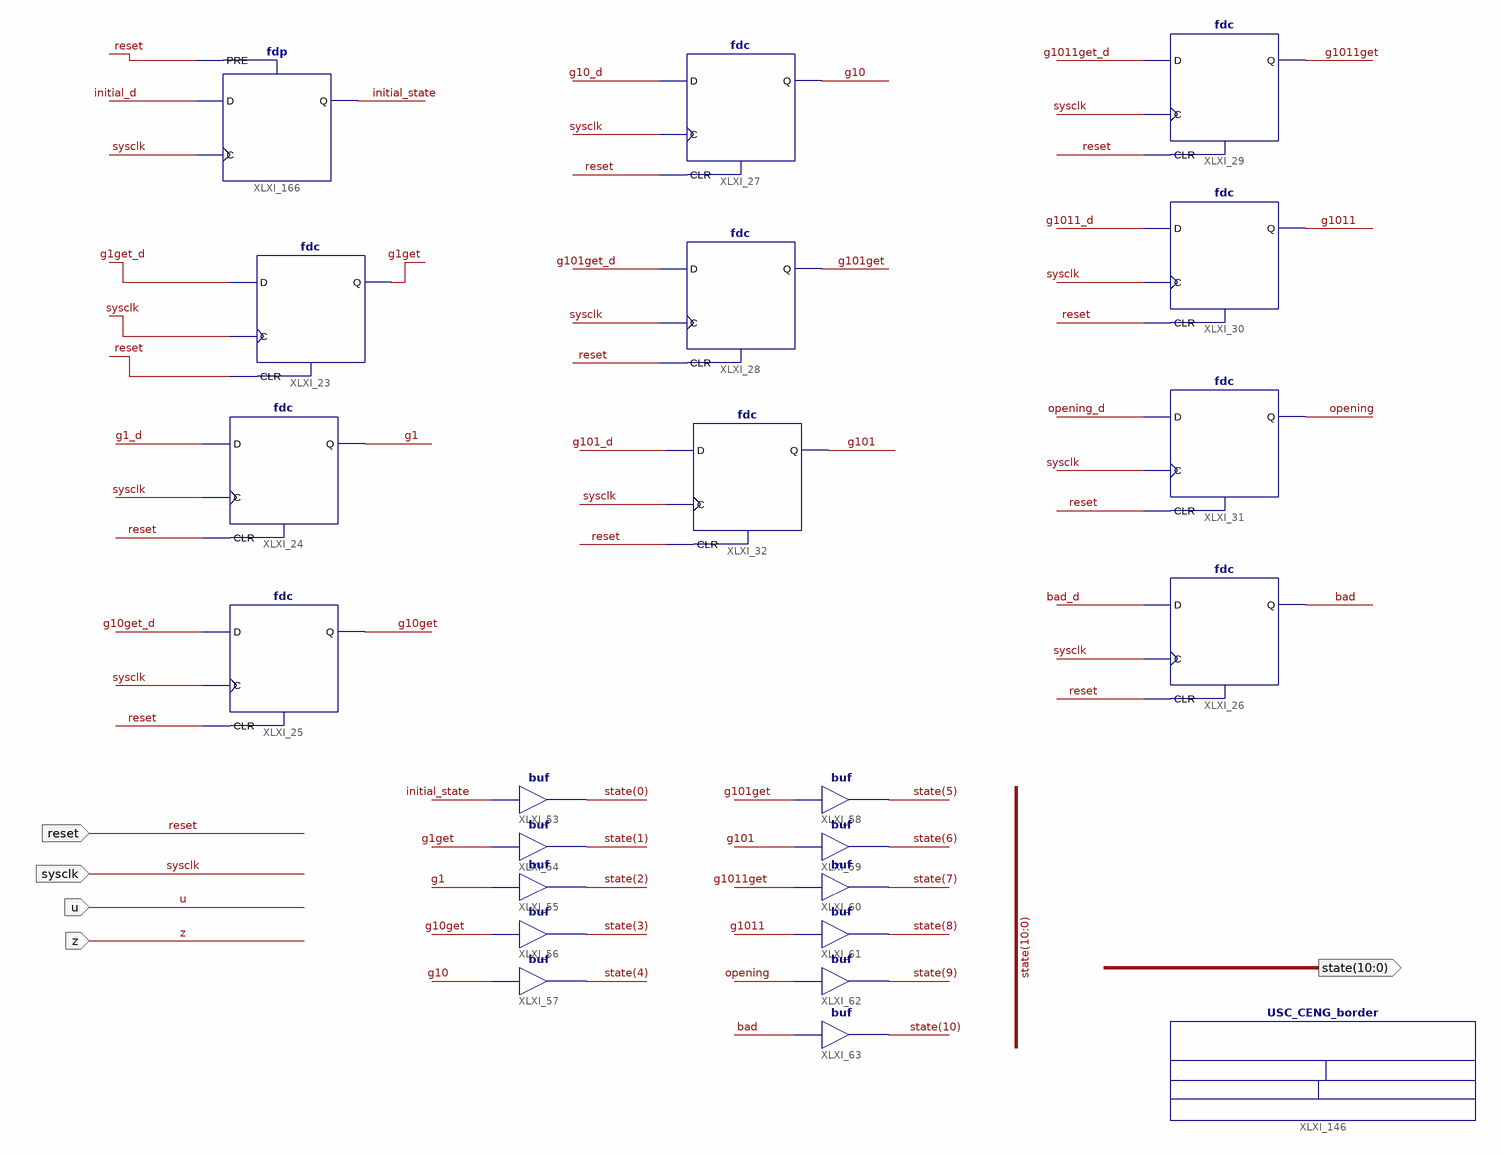
[diagram p0: schematic sheet 1]
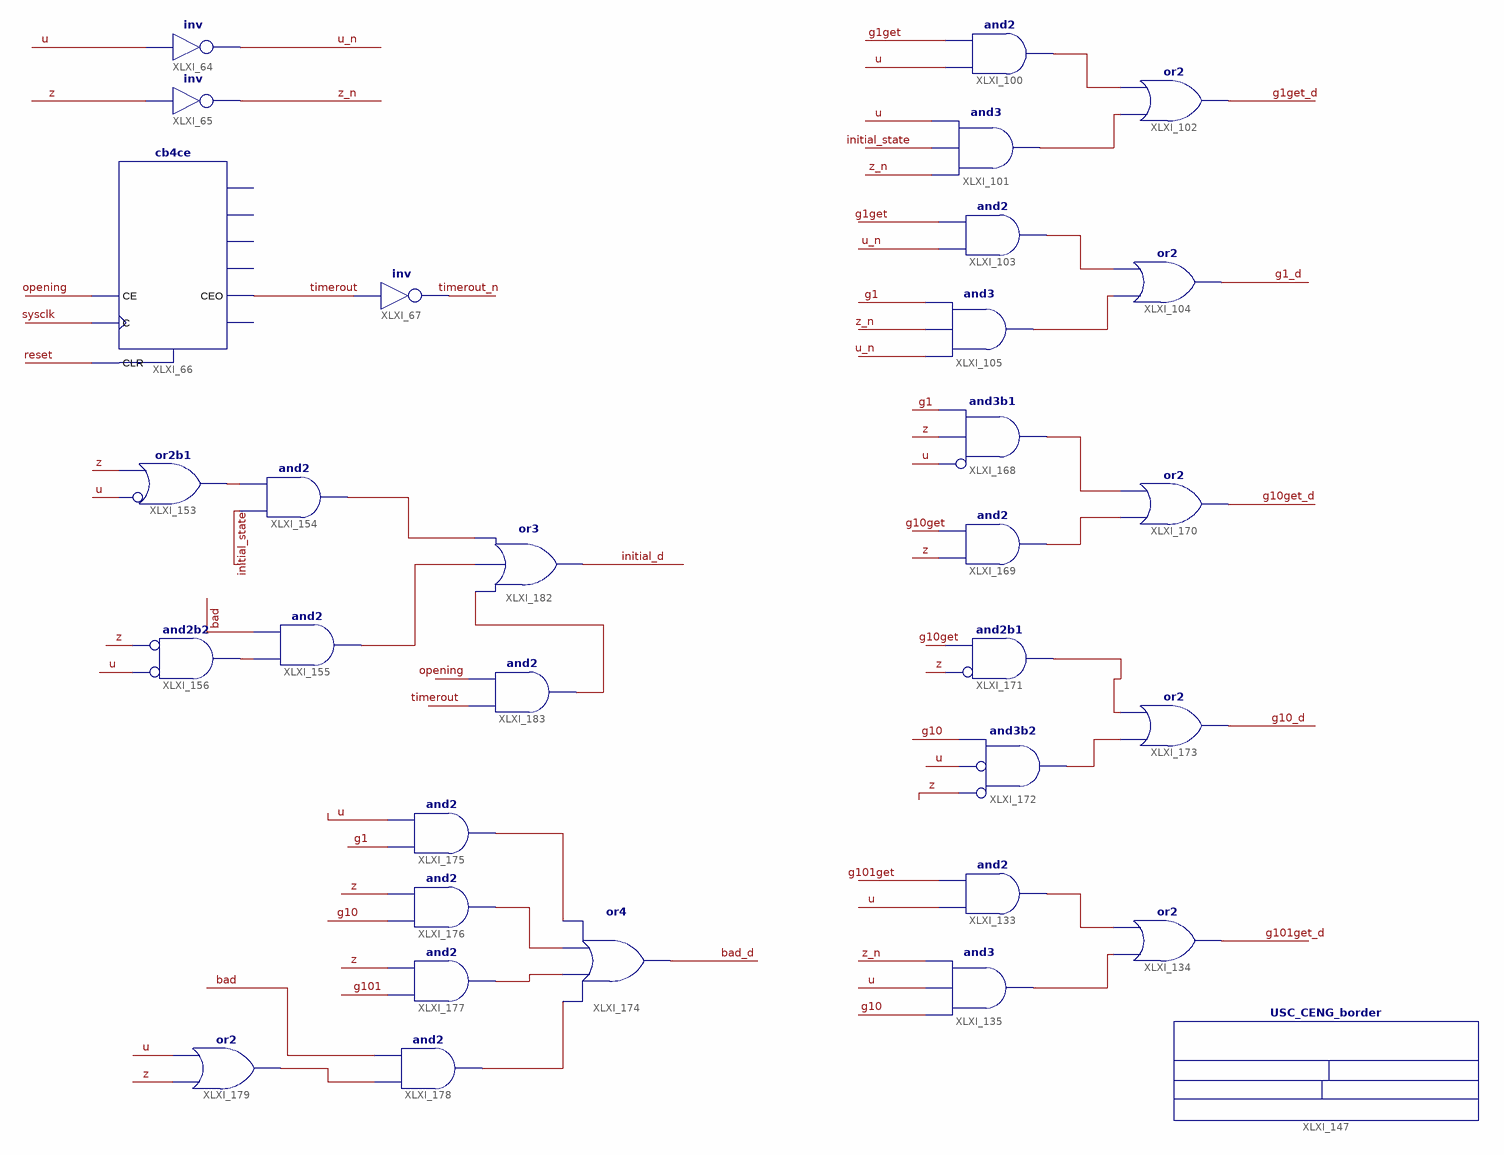
[diagram p1: schematic sheet 2]
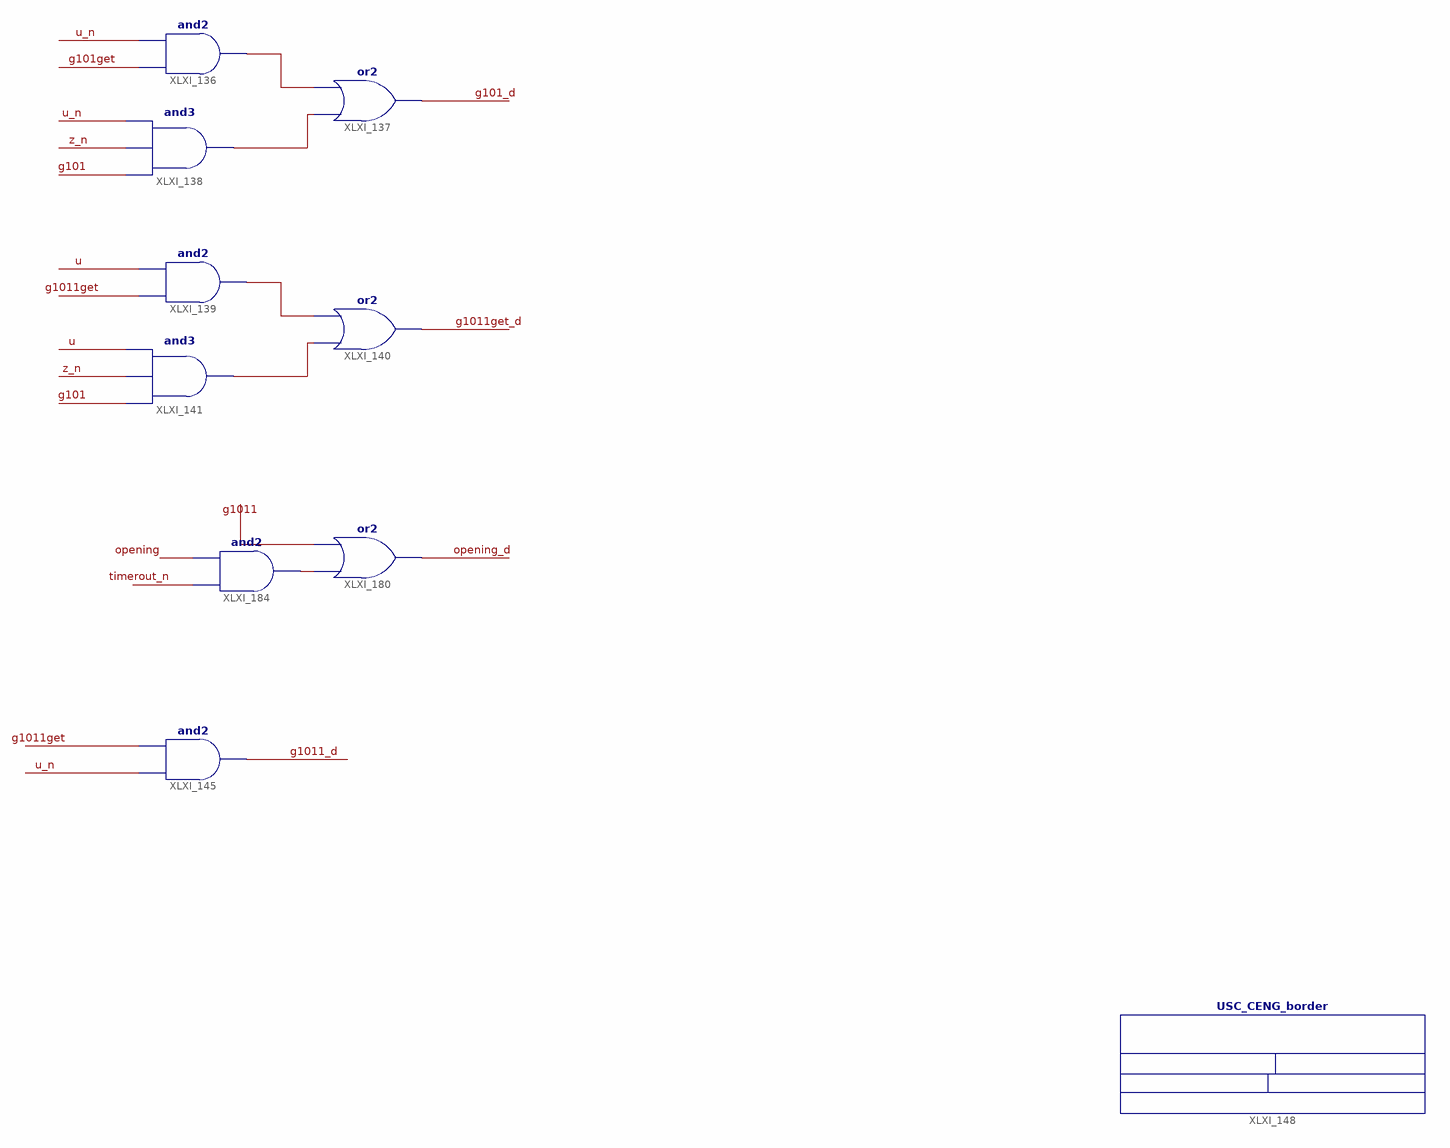
[diagram p2: schematic sheet 3]
// Xilinx ISE schematic ee201l_number_lock.sch (spartan6) as structural Verilog: 65 symbols, 5 ports
module ee201l_number_lock (
  input  sysclk,
  input  reset,
  input  u,
  input  z,
  output [10:0] state
);

  wire bad, bad_d, g1, g1_d, g1get, g1get_d, g10, g10_d, g10get, g10get_d, g101, g101_d, g101get, g101get_d,
       g1011, g1011_d, g1011get, g1011get_d, initial_d, initial_state, opening, opening_d, timerout,
       timerout_n, u_n, XLXN_275, XLXN_276, XLXN_289, XLXN_291, XLXN_379, XLXN_381, XLXN_388, XLXN_390,
       XLXN_397, XLXN_399, XLXN_404, XLXN_405, XLXN_422, XLXN_423, XLXN_424, XLXN_425, XLXN_431, XLXN_432,
       XLXN_438, XLXN_439, XLXN_440, XLXN_441, XLXN_449, XLXN_452, XLXN_458, z_n;

  fdc XLXI_23 (.C(sysclk), .CLR(reset), .D(g1get_d), .Q(g1get));
  fdc XLXI_29 (.C(sysclk), .CLR(reset), .D(g1011get_d), .Q(g1011get));
  fdc XLXI_31 (.C(sysclk), .CLR(reset), .D(opening_d), .Q(opening));
  fdc XLXI_26 (.C(sysclk), .CLR(reset), .D(bad_d), .Q(bad));
  fdc XLXI_30 (.C(sysclk), .CLR(reset), .D(g1011_d), .Q(g1011));
  fdc XLXI_27 (.C(sysclk), .CLR(reset), .D(g10_d), .Q(g10));
  fdc XLXI_28 (.C(sysclk), .CLR(reset), .D(g101get_d), .Q(g101get));
  fdc XLXI_32 (.C(sysclk), .CLR(reset), .D(g101_d), .Q(g101));
  fdc XLXI_24 (.C(sysclk), .CLR(reset), .D(g1_d), .Q(g1));
  fdc XLXI_25 (.C(sysclk), .CLR(reset), .D(g10get_d), .Q(g10get));
  not XLXI_64 (u_n, u);
  not XLXI_65 (z_n, z);
  cb4ce XLXI_66 (.C(sysclk), .CE(opening), .CLR(reset), .CEO(timerout));  // open: Q0, Q1, Q2, Q3, TC
  not XLXI_67 (timerout_n, timerout);
  and XLXI_100 (XLXN_275, u, g1get);
  or XLXI_102 (g1get_d, XLXN_276, XLXN_275);
  and XLXI_101 (XLXN_276, z_n, initial_state, u);
  and XLXI_103 (XLXN_289, u_n, g1get);
  or XLXI_104 (g1_d, XLXN_291, XLXN_289);
  and XLXI_105 (XLXN_291, u_n, z_n, g1);
  and XLXI_133 (XLXN_379, u, g101get);
  or XLXI_134 (g101get_d, XLXN_381, XLXN_379);
  and XLXI_135 (XLXN_381, g10, u, z_n);
  and XLXI_136 (XLXN_388, g101get, u_n);
  or XLXI_137 (g101_d, XLXN_390, XLXN_388);
  and XLXI_138 (XLXN_390, g101, z_n, u_n);
  and XLXI_139 (XLXN_397, g1011get, u);
  or XLXI_140 (g1011get_d, XLXN_399, XLXN_397);
  and XLXI_141 (XLXN_399, g101, z_n, u);
  and XLXI_145 (g1011_d, u_n, g1011get);
  USC_CENG_border XLXI_146 ();
  USC_CENG_border XLXI_147 ();
  USC_CENG_border XLXI_148 ();
  buf XLXI_58 (state[5], g101get);
  buf XLXI_59 (state[6], g101);
  buf XLXI_60 (state[7], g1011get);
  buf XLXI_61 (state[8], g1011);
  buf XLXI_62 (state[9], opening);
  buf XLXI_63 (state[10], bad);
  buf XLXI_53 (state[0], initial_state);
  buf XLXI_54 (state[1], g1get);
  buf XLXI_55 (state[2], g1);
  buf XLXI_56 (state[3], g10get);
  buf XLXI_57 (state[4], g10);
  or XLXI_153 (XLXN_404, ~u, z);  // or2b1
  and XLXI_154 (XLXN_422, initial_state, XLXN_404);
  and XLXI_155 (XLXN_423, XLXN_405, bad);
  and XLXI_156 (XLXN_405, ~u, ~z);  // and2b2
  fdp XLXI_166 (.C(sysclk), .D(initial_d), .PRE(reset), .Q(initial_state));
  and XLXI_168 (XLXN_424, ~u, z, g1);  // and3b1
  and XLXI_169 (XLXN_425, z, g10get);
  or XLXI_170 (g10get_d, XLXN_425, XLXN_424);
  and XLXI_171 (XLXN_431, ~z, g10get);  // and2b1
  and XLXI_172 (XLXN_432, ~z, ~u, g10);  // and3b2
  or XLXI_173 (g10_d, XLXN_432, XLXN_431);
  or XLXI_174 (bad_d, XLXN_441, XLXN_440, XLXN_439, XLXN_438);
  and XLXI_175 (XLXN_438, g1, u);
  and XLXI_176 (XLXN_439, g10, z);
  and XLXI_177 (XLXN_440, g101, z);
  and XLXI_178 (XLXN_441, XLXN_449, bad);
  or XLXI_179 (XLXN_449, z, u);
  or XLXI_180 (opening_d, XLXN_452, g1011);
  or XLXI_182 (initial_d, XLXN_458, XLXN_423, XLXN_422);
  and XLXI_183 (XLXN_458, timerout, opening);
  and XLXI_184 (XLXN_452, timerout_n, opening);
endmodule
